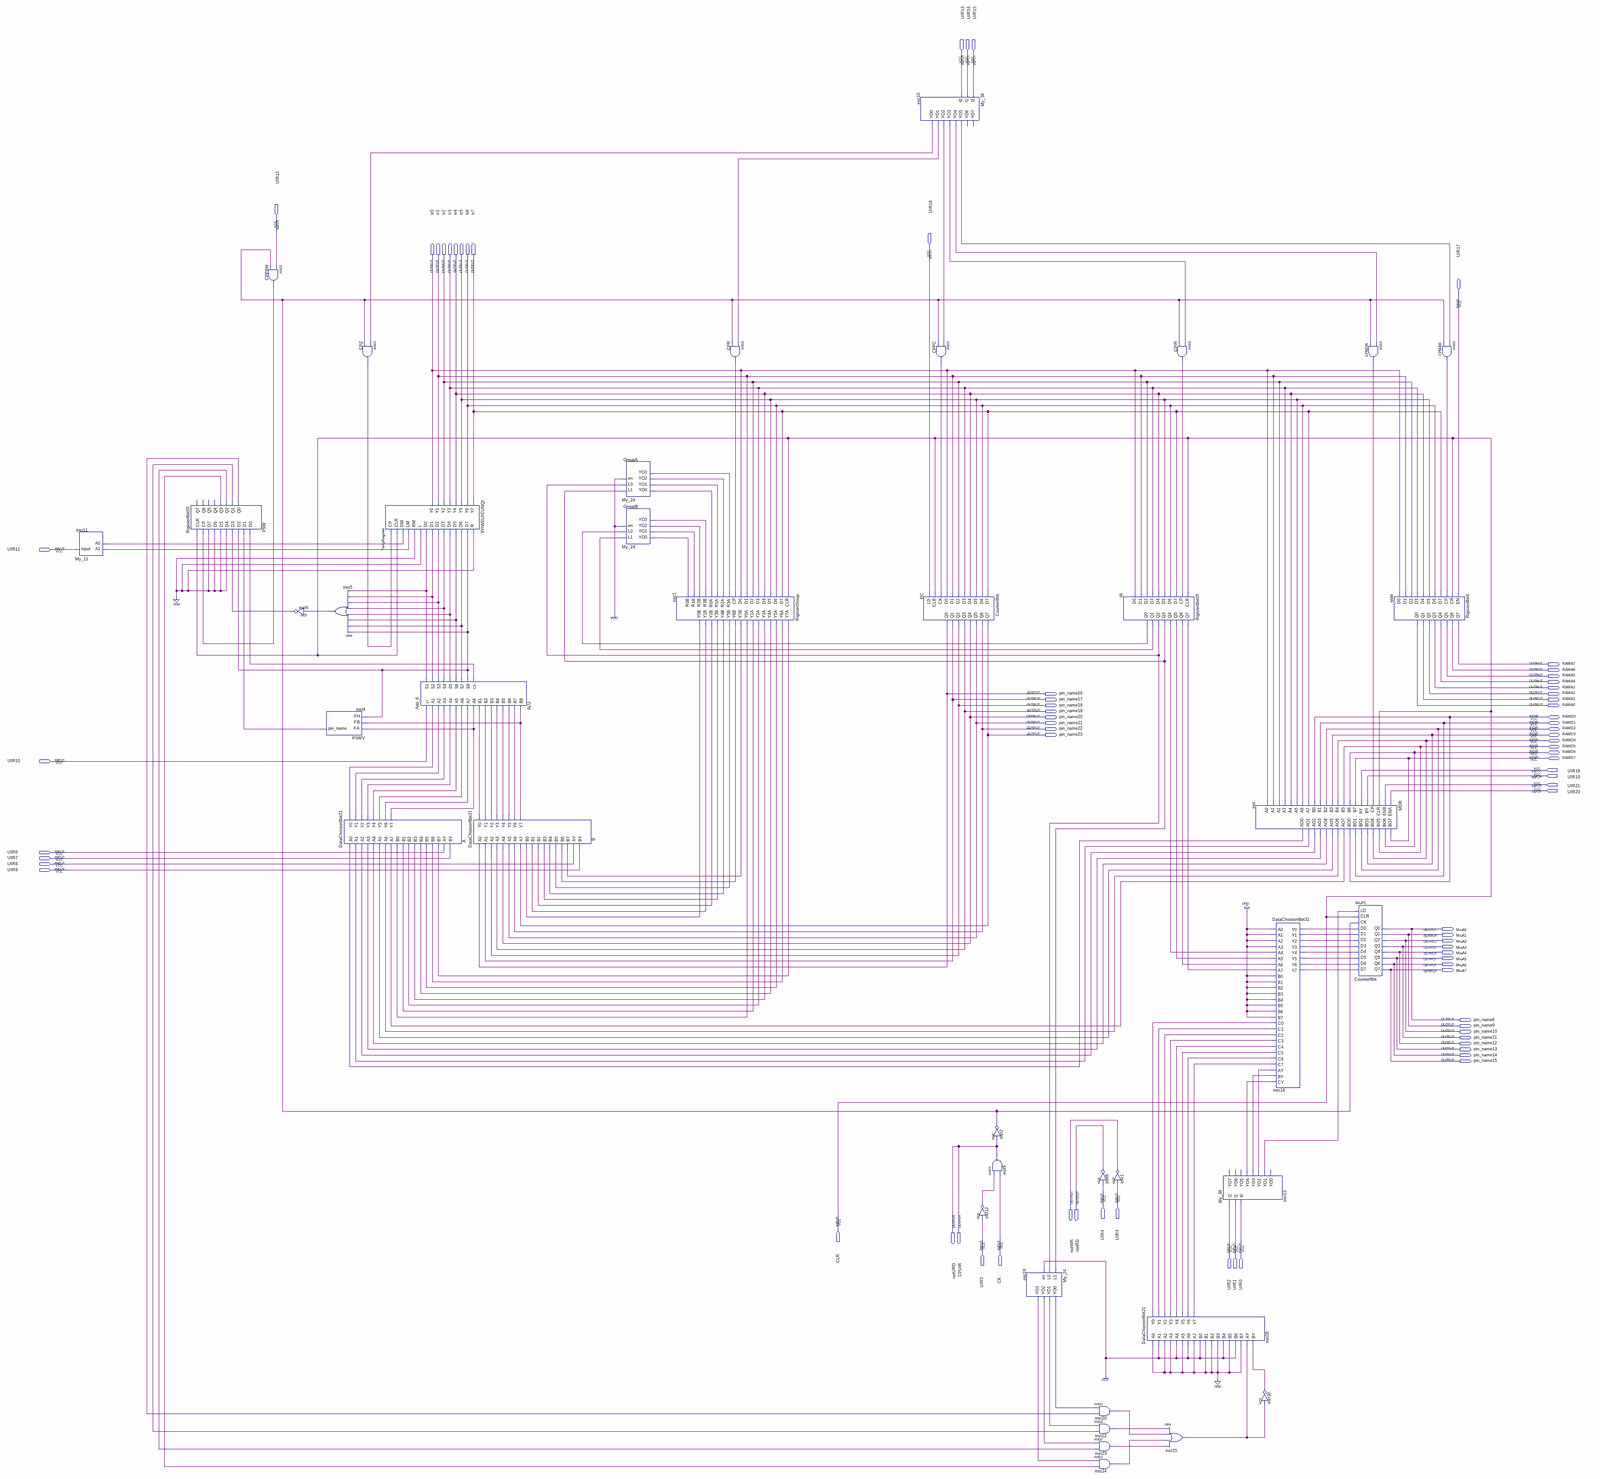
[diagram p0: schematic sheet, whole]
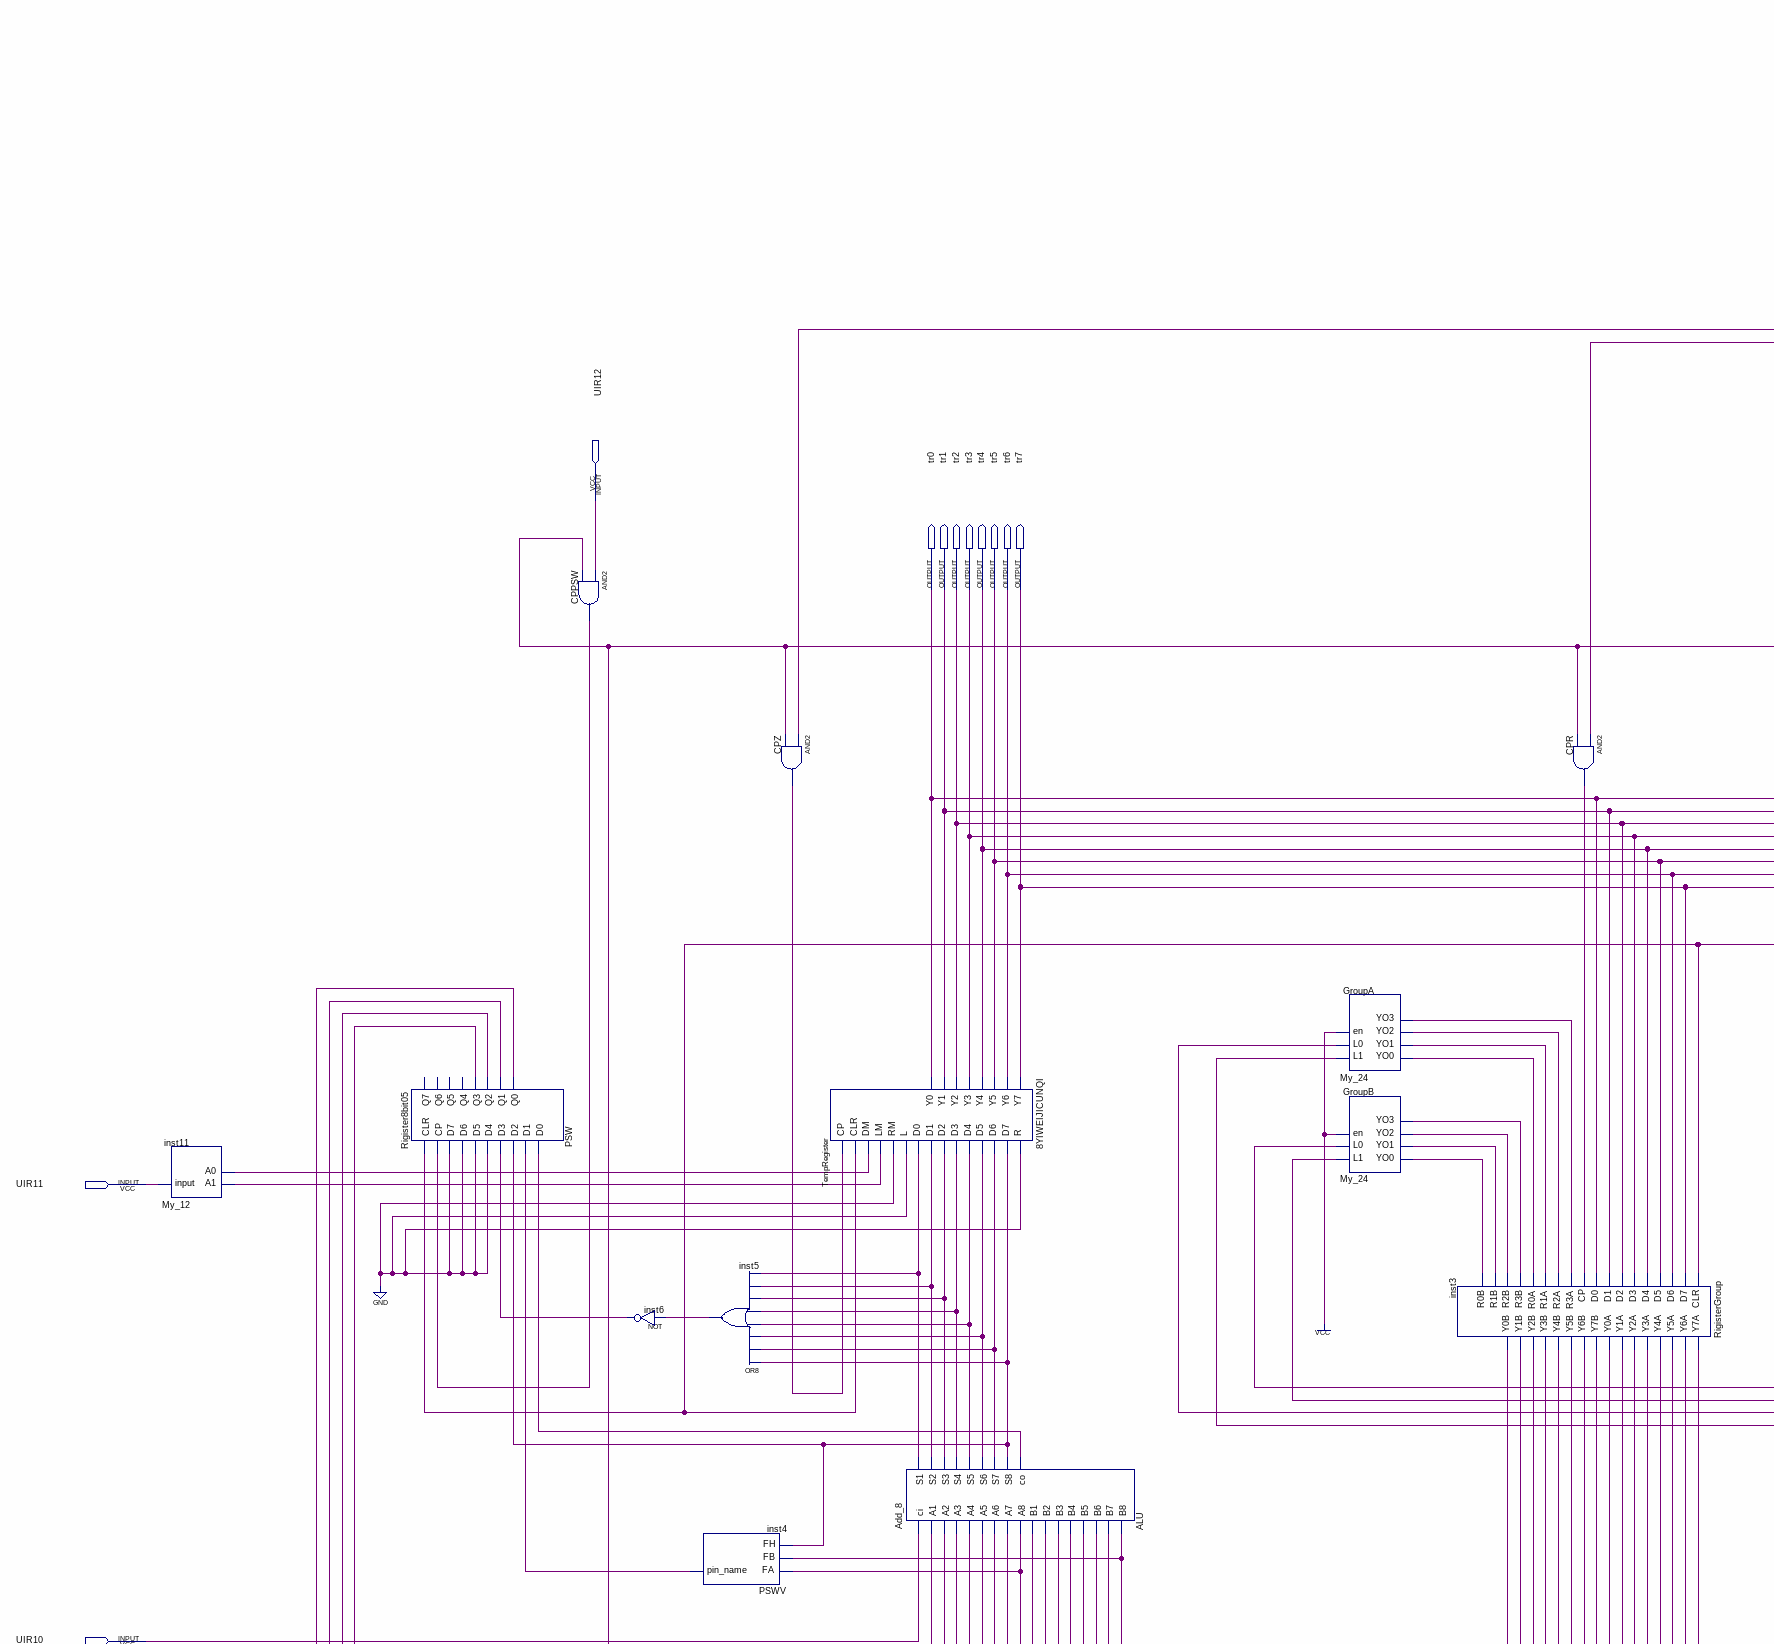
[diagram p1: schematic sheet, upper left part]
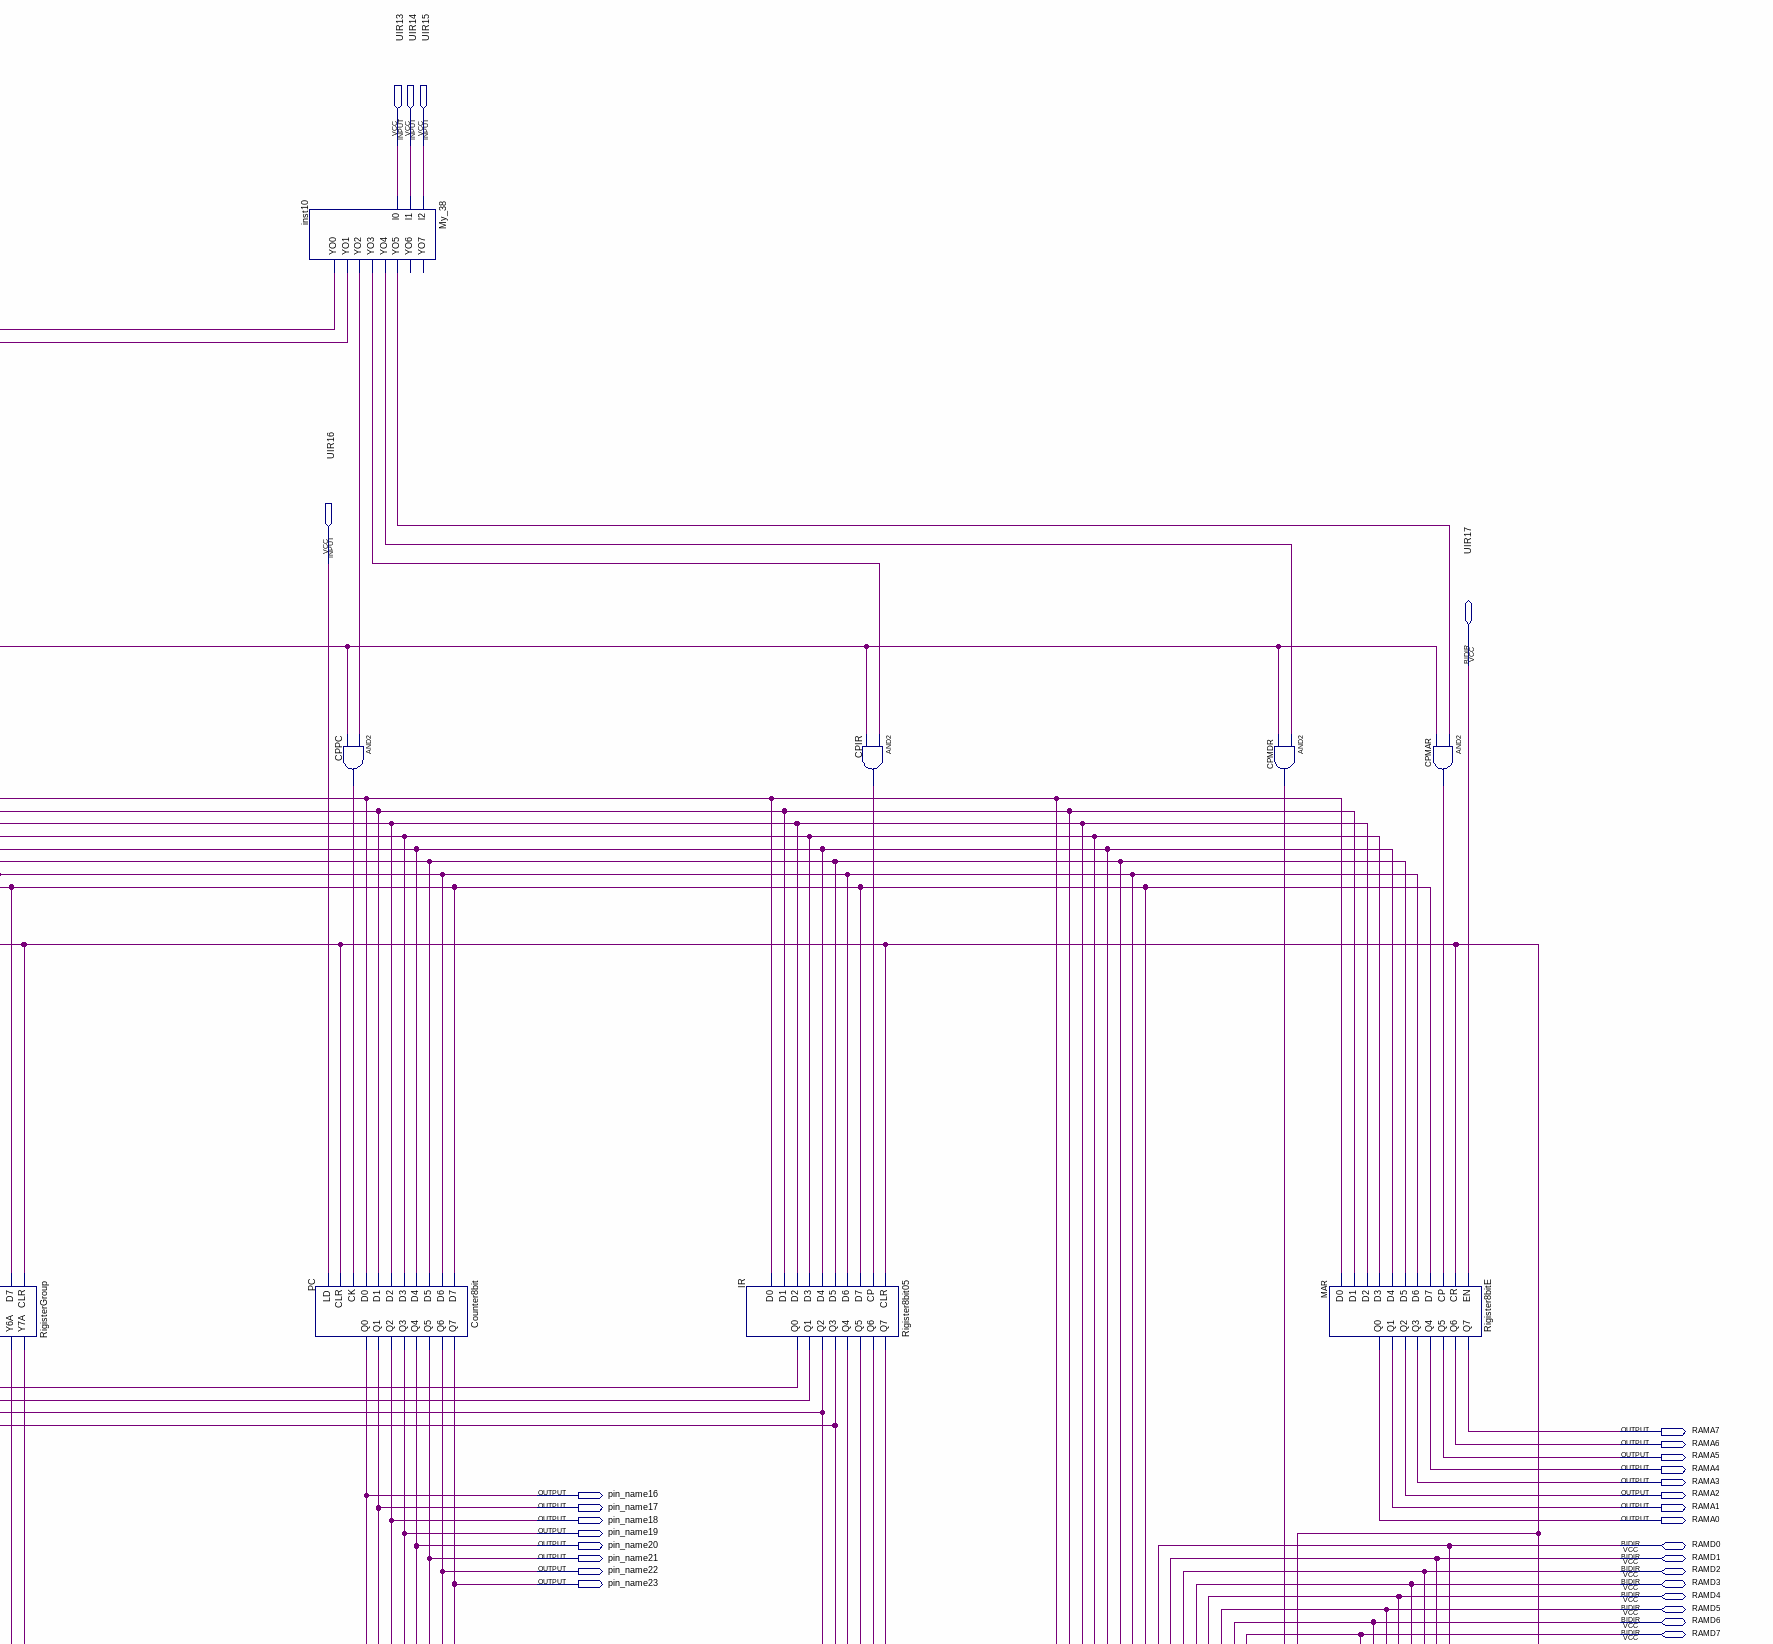
[diagram p2: schematic sheet, upper right part]
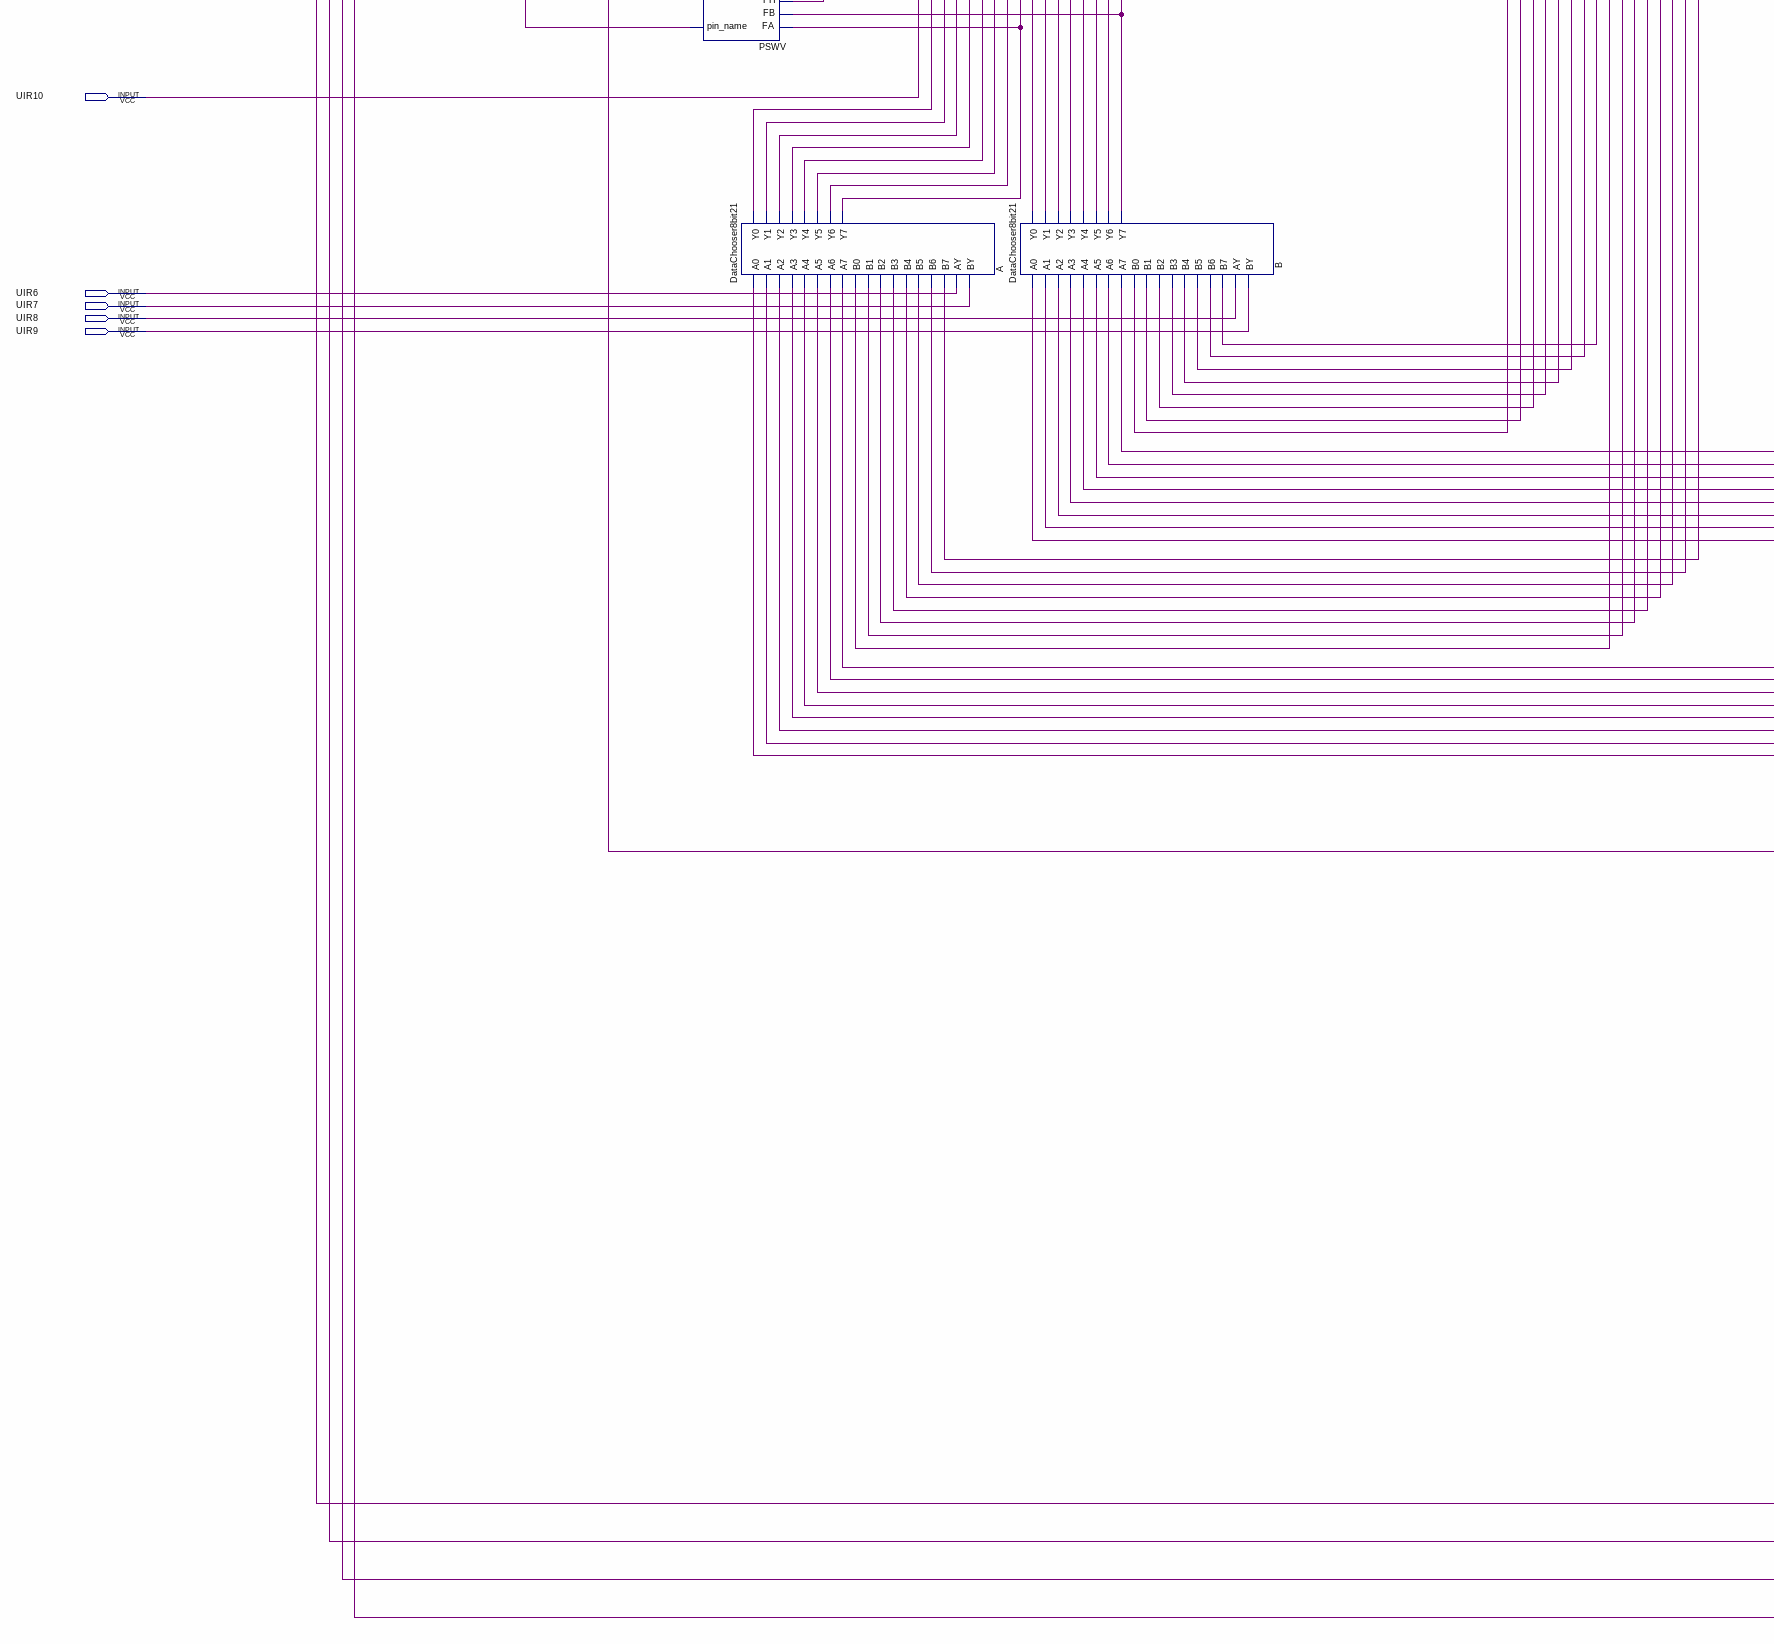
[diagram p3: schematic sheet, lower left part]
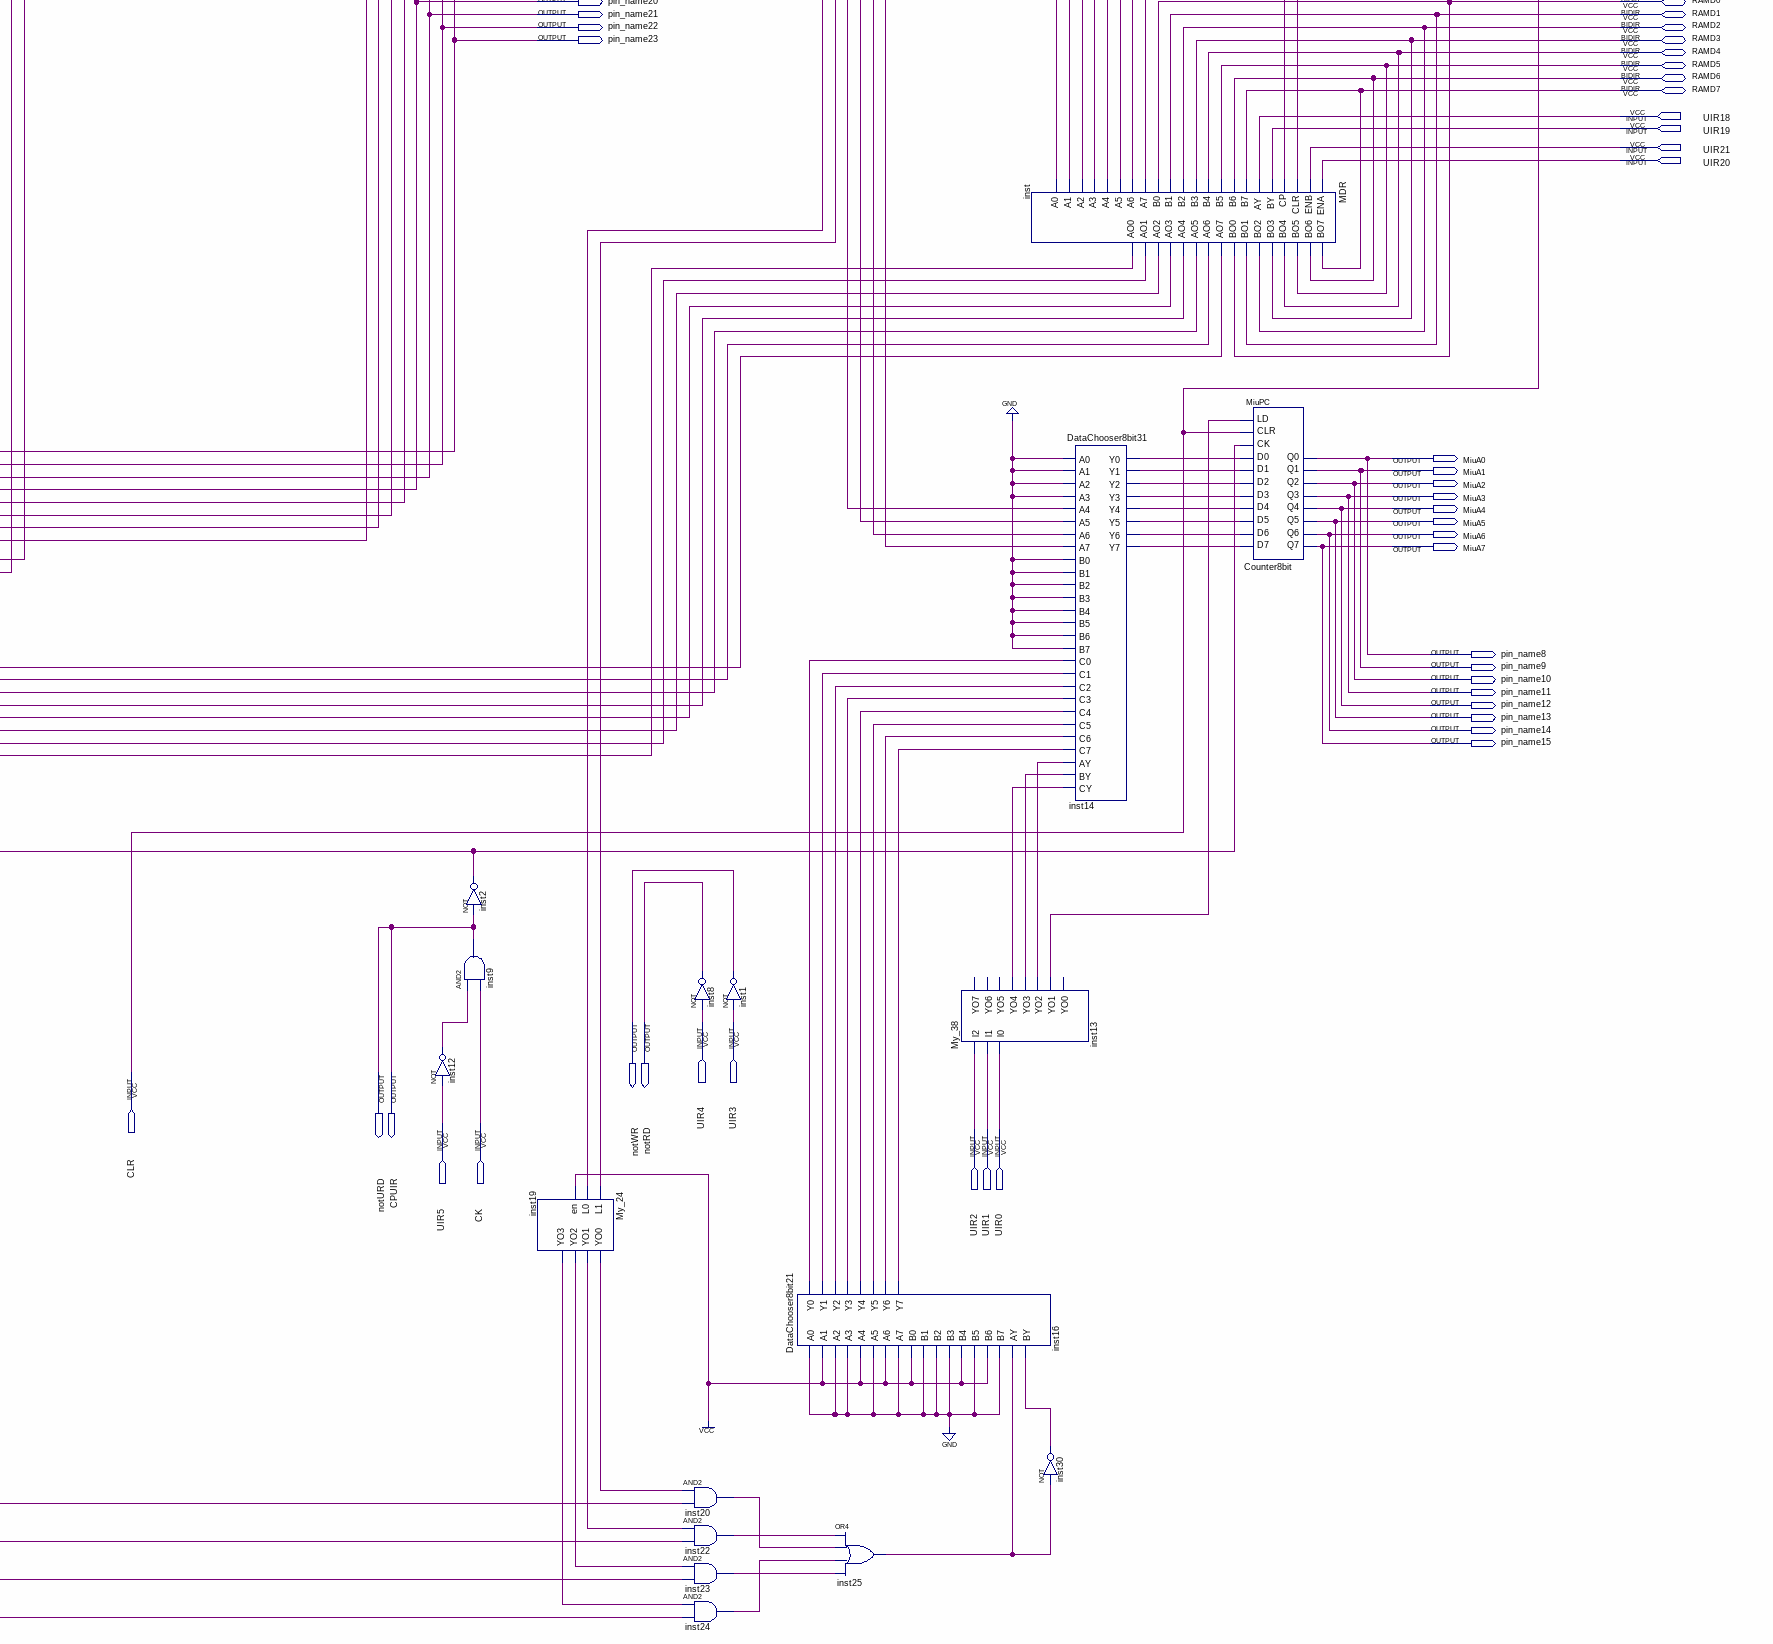
[diagram p4: schematic sheet, lower right part]
// Quartus schematic ModelMachine.bdf as structural Verilog: 40 symbols, 76 pins
module ModelMachine (
  input  UIR13,
  input  UIR14,
  input  UIR15,
  input  UIR12,
  input  UIR16,
  input  UIR11,
  input  UIR10,
  input  UIR18,
  input  UIR19,
  input  UIR21,
  input  UIR20,
  input  UIR6,
  input  UIR7,
  input  UIR8,
  input  UIR9,
  input  UIR4,
  input  UIR3,
  input  CLR,
  input  UIR5,
  input  CK,
  input  UIR2,
  input  UIR1,
  input  UIR0,
  inout  UIR17,
  inout  RAMD0,
  inout  RAMD1,
  inout  RAMD2,
  inout  RAMD3,
  inout  RAMD4,
  inout  RAMD5,
  inout  RAMD6,
  inout  RAMD7,
  output tr0,
  output tr1,
  output tr2,
  output tr3,
  output tr4,
  output tr5,
  output tr6,
  output tr7,
  output RAMA7,
  output RAMA6,
  output RAMA5,
  output RAMA4,
  output RAMA3,
  output pin_name16,
  output RAMA2,
  output pin_name17,
  output RAMA1,
  output pin_name18,
  output RAMA0,
  output pin_name19,
  output pin_name20,
  output pin_name21,
  output pin_name22,
  output pin_name23,
  output MiuA0,
  output MiuA1,
  output MiuA2,
  output MiuA3,
  output MiuA4,
  output MiuA5,
  output MiuA6,
  output MiuA7,
  output pin_name8,
  output pin_name9,
  output pin_name10,
  output pin_name11,
  output pin_name12,
  output pin_name13,
  output pin_name14,
  output pin_name15,
  output notWR,
  output notRD,
  output notURD,
  output CPUIR
);

  wire A_y0, A_y1, A_y2, A_y3, A_y4, A_y5, A_y6, A_y7, ALU_co, ALU_s1, ALU_s2, ALU_s3, ALU_s4, ALU_s5,
       ALU_s6, ALU_s7, ALU_s8, B_y0, B_y1, B_y2, B_y3, B_y4, B_y5, B_y6, B_y7, CPIR_out, CPMAR_out,
       CPMDR_out, CPPC_out, CPPSW_out, CPR_out, CPZ_out, GroupA_yo0, GroupA_yo1, GroupA_yo2, GroupA_yo3,
       GroupB_yo0, GroupB_yo1, GroupB_yo2, GroupB_yo3, inst2_out, inst3_y0a, inst3_y0b, inst3_y1a, inst3_y1b,
       inst3_y2a, inst3_y2b, inst3_y3a, inst3_y3b, inst3_y4a, inst3_y4b, inst3_y5a, inst3_y5b, inst3_y6a,
       inst3_y6b, inst3_y7a, inst3_y7b, inst4_pin_name, inst5_out, inst6_out, inst10_yo0, inst10_yo1,
       inst10_yo2, inst10_yo3, inst10_yo4, inst10_yo5, inst11_a0, inst11_a1, inst12_out, inst13_yo1,
       inst13_yo2, inst13_yo3, inst13_yo4, inst14_y0, inst14_y1, inst14_y2, inst14_y3, inst14_y4, inst14_y5,
       inst14_y6, inst14_y7, inst16_y0, inst16_y1, inst16_y2, inst16_y3, inst16_y4, inst16_y5, inst16_y6,
       inst16_y7, inst19_yo0, inst19_yo1, inst19_yo2, inst19_yo3, inst20_out, inst22_out, inst23_out,
       inst24_out, inst25_out, inst30_out, inst_ao0, inst_ao1, inst_ao2, inst_ao3, inst_ao4, inst_ao5,
       inst_ao6, inst_ao7, IR_q0, IR_q1, IR_q2, IR_q3, IR_q4, IR_q5, IR_q6, IR_q7, PSW_q0, PSW_q1, PSW_q2,
       PSW_q3;

  My_12 inst11 (.\input (UIR11), .A1(inst11_a1), .A0(inst11_a0));
  Rigister8bit05 PSW (
    .CLR(CLR), .CP(CPPSW_out), .D7(1'b0), .D6(1'b0), .D5(1'b0), .D4(1'b0), .D3(inst6_out), .D2(ALU_s8),
    .D1(inst4_pin_name), .D0(ALU_co), .Q3(PSW_q3), .Q2(PSW_q2), .Q1(PSW_q1), .Q0(PSW_q0));  // open: Q7, Q6, Q5, Q4
  and CPPSW (CPPSW_out, UIR12, inst2_out);
  not inst6 (inst6_out, inst5_out);
  or inst5 (inst5_out, ALU_s8, ALU_s7, ALU_s6, ALU_s5, ALU_s4, ALU_s3, ALU_s2, ALU_s1);
  PSWV inst4 (.FA(A_y7), .FB(B_y7), .FH(ALU_s8), .pin_name(inst4_pin_name));
  DataChooser8bit21 A (
    .A0(inst_ao0), .A1(inst_ao1), .A2(inst_ao2), .A3(inst_ao3), .A4(inst_ao4), .A5(inst_ao5), .A6(inst_ao6),
    .A7(inst_ao7), .B0(inst3_y0a), .B1(inst3_y1a), .B2(inst3_y2a), .B3(inst3_y3a), .B4(inst3_y4a),
    .B5(inst3_y5a), .B6(inst3_y6a), .B7(inst3_y7a), .AY(UIR6), .BY(UIR7), .Y0(A_y0), .Y1(A_y1), .Y2(A_y2),
    .Y3(A_y3), .Y4(A_y4), .Y5(A_y5), .Y6(A_y6), .Y7(A_y7));
  and CPZ (CPZ_out, inst10_yo0, inst2_out);
  \8YIWEIJICUNQI  TempRegister (
    .R(1'b0), .D7(ALU_s8), .D6(ALU_s7), .D5(ALU_s6), .D4(ALU_s5), .D3(ALU_s4), .D2(ALU_s3), .D1(ALU_s2),
    .D0(ALU_s1), .L(1'b0), .RM(1'b0), .LM(inst11_a1), .DM(inst11_a0), .CLR(CLR), .CP(CPZ_out), .Y7(tr7),
    .Y6(tr6), .Y5(tr5), .Y4(tr4), .Y3(tr3), .Y2(tr2), .Y1(tr1), .Y0(tr0));
  Add_8 ALU (
    .ci(UIR10), .A1(A_y0), .A2(A_y1), .A3(A_y2), .A4(A_y3), .A5(A_y4), .A6(A_y5), .A7(A_y6), .A8(A_y7),
    .B1(B_y0), .B2(B_y1), .B3(B_y2), .B4(B_y3), .B5(B_y4), .B6(B_y5), .B7(B_y6), .B8(B_y7), .S1(ALU_s1),
    .S2(ALU_s2), .S3(ALU_s3), .S4(ALU_s4), .S5(ALU_s5), .S6(ALU_s6), .S7(ALU_s7), .S8(ALU_s8), .co(ALU_co));
  DataChooser8bit21 B (
    .A0(pin_name16), .A1(pin_name17), .A2(pin_name18), .A3(pin_name19), .A4(pin_name20), .A5(pin_name21),
    .A6(pin_name22), .A7(pin_name23), .B0(inst3_y0b), .B1(inst3_y1b), .B2(inst3_y2b), .B3(inst3_y3b),
    .B4(inst3_y4b), .B5(inst3_y5b), .B6(inst3_y6b), .B7(inst3_y7b), .AY(UIR8), .BY(UIR9), .Y0(B_y0),
    .Y1(B_y1), .Y2(B_y2), .Y3(B_y3), .Y4(B_y4), .Y5(B_y5), .Y6(B_y6), .Y7(B_y7));
  My_24 GroupA (
    .L1(IR_q3), .L0(IR_q2), .en(1'b1), .YO0(GroupA_yo0), .YO1(GroupA_yo1), .YO2(GroupA_yo2), .YO3(GroupA_yo3));
  My_24 GroupB (
    .L1(IR_q1), .L0(IR_q0), .en(1'b1), .YO0(GroupB_yo0), .YO1(GroupB_yo1), .YO2(GroupB_yo2), .YO3(GroupB_yo3));
  RigisterGroup inst3 (
    .CLR(CLR), .D7(tr7), .D6(tr6), .D5(tr5), .D4(tr4), .D3(tr3), .D2(tr2), .D1(tr1), .D0(tr0), .CP(CPR_out),
    .R3A(GroupA_yo3), .R2A(GroupA_yo2), .R1A(GroupA_yo1), .R0A(GroupA_yo0), .R3B(GroupB_yo3),
    .R2B(GroupB_yo2), .R1B(GroupB_yo1), .R0B(GroupB_yo0), .Y7A(inst3_y7a), .Y6A(inst3_y6a), .Y5A(inst3_y5a),
    .Y4A(inst3_y4a), .Y3A(inst3_y3a), .Y2A(inst3_y2a), .Y1A(inst3_y1a), .Y0A(inst3_y0a), .Y7B(inst3_y7b),
    .Y6B(inst3_y6b), .Y5B(inst3_y5b), .Y4B(inst3_y4b), .Y3B(inst3_y3b), .Y2B(inst3_y2b), .Y1B(inst3_y1b),
    .Y0B(inst3_y0b));
  and CPR (CPR_out, inst10_yo1, inst2_out);
  My_38 inst10 (
    .l2(UIR15), .l1(UIR14), .l0(UIR13), .YO5(inst10_yo5), .YO4(inst10_yo4), .YO3(inst10_yo3),
    .YO2(inst10_yo2), .YO1(inst10_yo1), .YO0(inst10_yo0));  // open: YO7, YO6
  Counter8bit PC (
    .D7(tr7), .D6(tr6), .D5(tr5), .D4(tr4), .D3(tr3), .D2(tr2), .D1(tr1), .D0(tr0), .CK(CPPC_out), .CLR(CLR),
    .LD(UIR16), .Q7(pin_name23), .Q6(pin_name22), .Q5(pin_name21), .Q4(pin_name20), .Q3(pin_name19),
    .Q2(pin_name18), .Q1(pin_name17), .Q0(pin_name16));
  and CPPC (CPPC_out, inst10_yo2, inst2_out);
  not inst12 (inst12_out, UIR5);
  not inst2 (inst2_out, CPUIR);
  and inst9 (CPUIR, inst12_out, CK);
  My_24 inst19 (
    .L1(IR_q3), .L0(IR_q2), .en(1'b1), .YO0(inst19_yo0), .YO1(inst19_yo1), .YO2(inst19_yo2), .YO3(inst19_yo3));
  and inst20 (inst20_out, inst19_yo0, PSW_q0);
  and inst22 (inst22_out, inst19_yo1, PSW_q1);
  and inst23 (inst23_out, inst19_yo2, PSW_q2);
  and inst24 (inst24_out, inst19_yo3, PSW_q3);
  Rigister8bit05 IR (
    .CLR(CLR), .CP(CPIR_out), .D7(tr7), .D6(tr6), .D5(tr5), .D4(tr4), .D3(tr3), .D2(tr2), .D1(tr1), .D0(tr0),
    .Q7(IR_q7), .Q6(IR_q6), .Q5(IR_q5), .Q4(IR_q4), .Q3(IR_q3), .Q2(IR_q2), .Q1(IR_q1), .Q0(IR_q0));
  not inst8 (notRD, UIR4);
  not inst1 (notWR, UIR3);
  DataChooser8bit21 inst16 (
    .A0(1'b0), .A1(1'b1), .A2(1'b0), .A3(1'b0), .A4(1'b1), .A5(1'b0), .A6(1'b1), .A7(1'b0), .B0(1'b1),
    .B1(1'b0), .B2(1'b0), .B3(1'b0), .B4(1'b1), .B5(1'b0), .B6(1'b1), .B7(1'b0), .AY(inst25_out),
    .BY(inst30_out), .Y0(inst16_y0), .Y1(inst16_y1), .Y2(inst16_y2), .Y3(inst16_y3), .Y4(inst16_y4),
    .Y5(inst16_y5), .Y6(inst16_y6), .Y7(inst16_y7));
  or inst25 (inst25_out, inst22_out, inst20_out, inst24_out, inst23_out);
  and CPIR (CPIR_out, inst10_yo3, inst2_out);
  My_38 inst13 (
    .l2(UIR2), .l1(UIR1), .l0(UIR0), .YO4(inst13_yo4), .YO3(inst13_yo3), .YO2(inst13_yo2), .YO1(inst13_yo1));  // open: YO7, YO6, YO5, YO0
  MDR inst (
    .ENA(UIR20), .ENB(UIR21), .CLR(CLR), .CP(CPMDR_out), .BY(UIR19), .AY(UIR18), .B7(RAMD7), .B6(RAMD6),
    .B5(RAMD5), .B4(RAMD4), .B3(RAMD3), .B2(RAMD2), .B1(RAMD1), .B0(RAMD0), .A7(tr7), .A6(tr6), .A5(tr5),
    .A4(tr4), .A3(tr3), .A2(tr2), .A1(tr1), .A0(tr0), .BO7(RAMD7), .BO6(RAMD6), .BO5(RAMD5), .BO4(RAMD4),
    .BO3(RAMD3), .BO2(RAMD2), .BO1(RAMD1), .BO0(RAMD0), .AO7(inst_ao7), .AO6(inst_ao6), .AO5(inst_ao5),
    .AO4(inst_ao4), .AO3(inst_ao3), .AO2(inst_ao2), .AO1(inst_ao1), .AO0(inst_ao0));
  not inst30 (inst30_out, inst25_out);
  DataChooser8bit31 inst14 (
    .A0(1'b0), .A1(1'b0), .A2(1'b0), .A3(1'b0), .A4(IR_q4), .A5(IR_q5), .A6(IR_q6), .A7(IR_q7), .B0(1'b0),
    .B1(1'b0), .B2(1'b0), .B3(1'b0), .B4(1'b0), .B5(1'b0), .B6(1'b0), .B7(1'b0), .C0(inst16_y0),
    .C1(inst16_y1), .C2(inst16_y2), .C3(inst16_y3), .C4(inst16_y4), .C5(inst16_y5), .C6(inst16_y6),
    .C7(inst16_y7), .AY(inst13_yo2), .BY(inst13_yo3), .CY(inst13_yo4), .Y0(inst14_y0), .Y1(inst14_y1),
    .Y2(inst14_y2), .Y3(inst14_y3), .Y4(inst14_y4), .Y5(inst14_y5), .Y6(inst14_y6), .Y7(inst14_y7));
  Counter8bit MiuPC (
    .D7(inst14_y7), .D6(inst14_y6), .D5(inst14_y5), .D4(inst14_y4), .D3(inst14_y3), .D2(inst14_y2),
    .D1(inst14_y1), .D0(inst14_y0), .CK(inst2_out), .CLR(CLR), .LD(inst13_yo1), .Q7(MiuA7), .Q6(MiuA6),
    .Q5(MiuA5), .Q4(MiuA4), .Q3(MiuA3), .Q2(MiuA2), .Q1(MiuA1), .Q0(MiuA0));
  and CPMDR (CPMDR_out, inst10_yo4, inst2_out);
  Rigister8bitE MAR (
    .EN(UIR17), .CR(CLR), .CP(CPMAR_out), .D7(tr7), .D6(tr6), .D5(tr5), .D4(tr4), .D3(tr3), .D2(tr2),
    .D1(tr1), .D0(tr0), .Q7(RAMA7), .Q6(RAMA6), .Q5(RAMA5), .Q4(RAMA4), .Q3(RAMA3), .Q2(RAMA2), .Q1(RAMA1),
    .Q0(RAMA0));
  and CPMAR (CPMAR_out, inst10_yo5, inst2_out);

  assign notURD = CPUIR;
  assign pin_name8 = MiuA0;
  assign pin_name9 = MiuA1;
  assign pin_name10 = MiuA2;
  assign pin_name11 = MiuA3;
  assign pin_name12 = MiuA4;
  assign pin_name13 = MiuA5;
  assign pin_name14 = MiuA6;
  assign pin_name15 = MiuA7;
endmodule
